# Altium schematic sheet 2CH_Digital_Isolator.SchDoc: STM32F446 CNC
size B; Author: AM; CompanyName: Expatria Technologies; DrawnBy: A.Marles; Engineer: AM; Organization: Expatria Technolgoies; DocumentNumber: 9; SheetNumber: 9; SheetTotal: 14
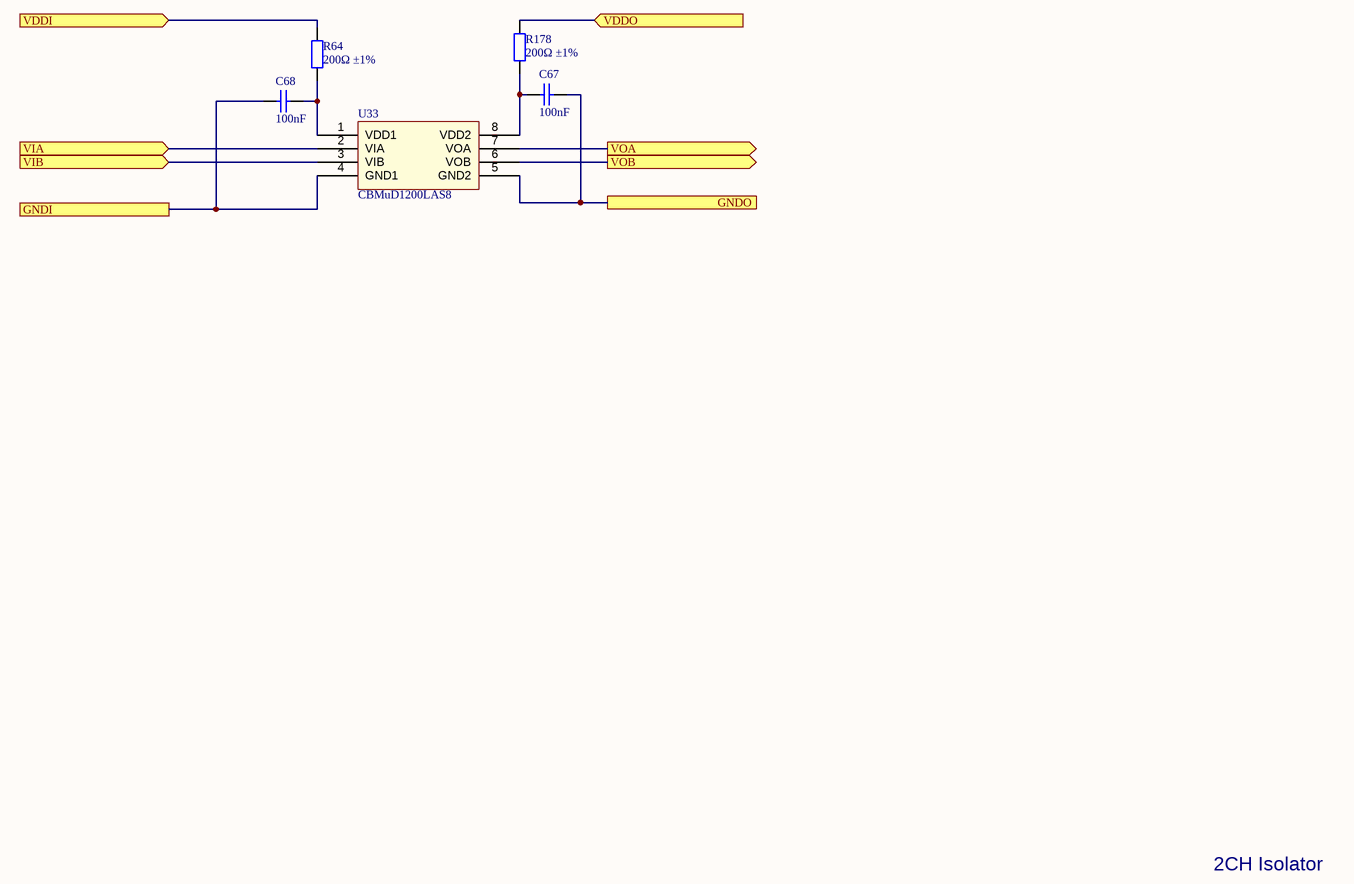
[diagram p0: 2CH_Digital_Isolator.SchDoc]

## Parts
C67  100nF  [0603_C]
C68  100nF  [0603_C]
R64  200Ω ±1%  [0603_R]
R178  200Ω ±1%  [0603_R]
U33  CBMuD1200LAS8  [SOIC-8_150mil]

## Ports
GNDI, GNDO, VDDI (in), VDDO (in), VIA (in), VIB (in), VOA (out), VOB (out)

## Nets
GNDI: C68.2 U33.4(GND1) ; port GNDI
GNDO: C67.1 U33.5(GND2) ; port GNDO
VDDI: R64.2 ; port VDDI
VDDO: R178.2 ; port VDDO
VIA: U33.2(VIA) ; port VIA
VIB: U33.3(VIB) ; port VIB
VOA: U33.7(VOA) ; port VOA
VOB: U33.6(VOB) ; port VOB
NetC67_2: C67.2 R178.1 U33.8(VDD2)
NetC68_1: C68.1 R64.1 U33.1(VDD1)

## Notes on the sheet
- 2CH Isolator
- SHEET
- Expatria Technologies
- 1136 Glade Court
- Port Coquitlam, BC V3B 1R5
- PROJECT
- SIZE
- ENGR
- MODIFIED
- DOCUMENT
- REV
- Copyright Expatria Technologies 2022. This document describes Open Hardware and is licensed under the CERN-OHL-S v2. No warranty is implied or expressed.
- EMAIL: INFO@EXPATRIA.CA
- B
- /

## Library data of the parts
C67 C68 = 0603 100nF (104) 10% 50V: Chip capacitors; Manufacturer: YAGEO; PartNumber: CC0603KRX7R9BB104; Tolerance: 10%; Voltage: 50V; ComponentLink1Description: Supplier link; ComponentLink1URL: http://www.szlcsc.com/product/details_15331.html; Package: 0603; Supplier: LC; SuppliersPartNumber: C14663; Capacitance: 100nF
R64 R178 = 0603 200R (2000) 1%: Chip resistor; Manufacturer: Uniroyal Elec; PartNumber: 0603WAF2000T5E; Power: 1/10W; ComponentLink1Description: Supplier link; ComponentLink1URL: http://www.szlcsc.com/product/details_8708.html; Package: 0603; Supplier: LC; SuppliersPartNumber: C8218; Resistance: 200Ω; Tolerance: 1%
U33 = CBMuD1200LAS8: Dual Channel Isolator; Package: SOIC-8_150mil; Supplier: LC; SuppliersPartNumber: C476470; ComponentLink1Description: 供应商链接; ComponentLink1URL: http://www.szlcsc.com/product/details_10199.html